# Altium project version 2.PrjPcb
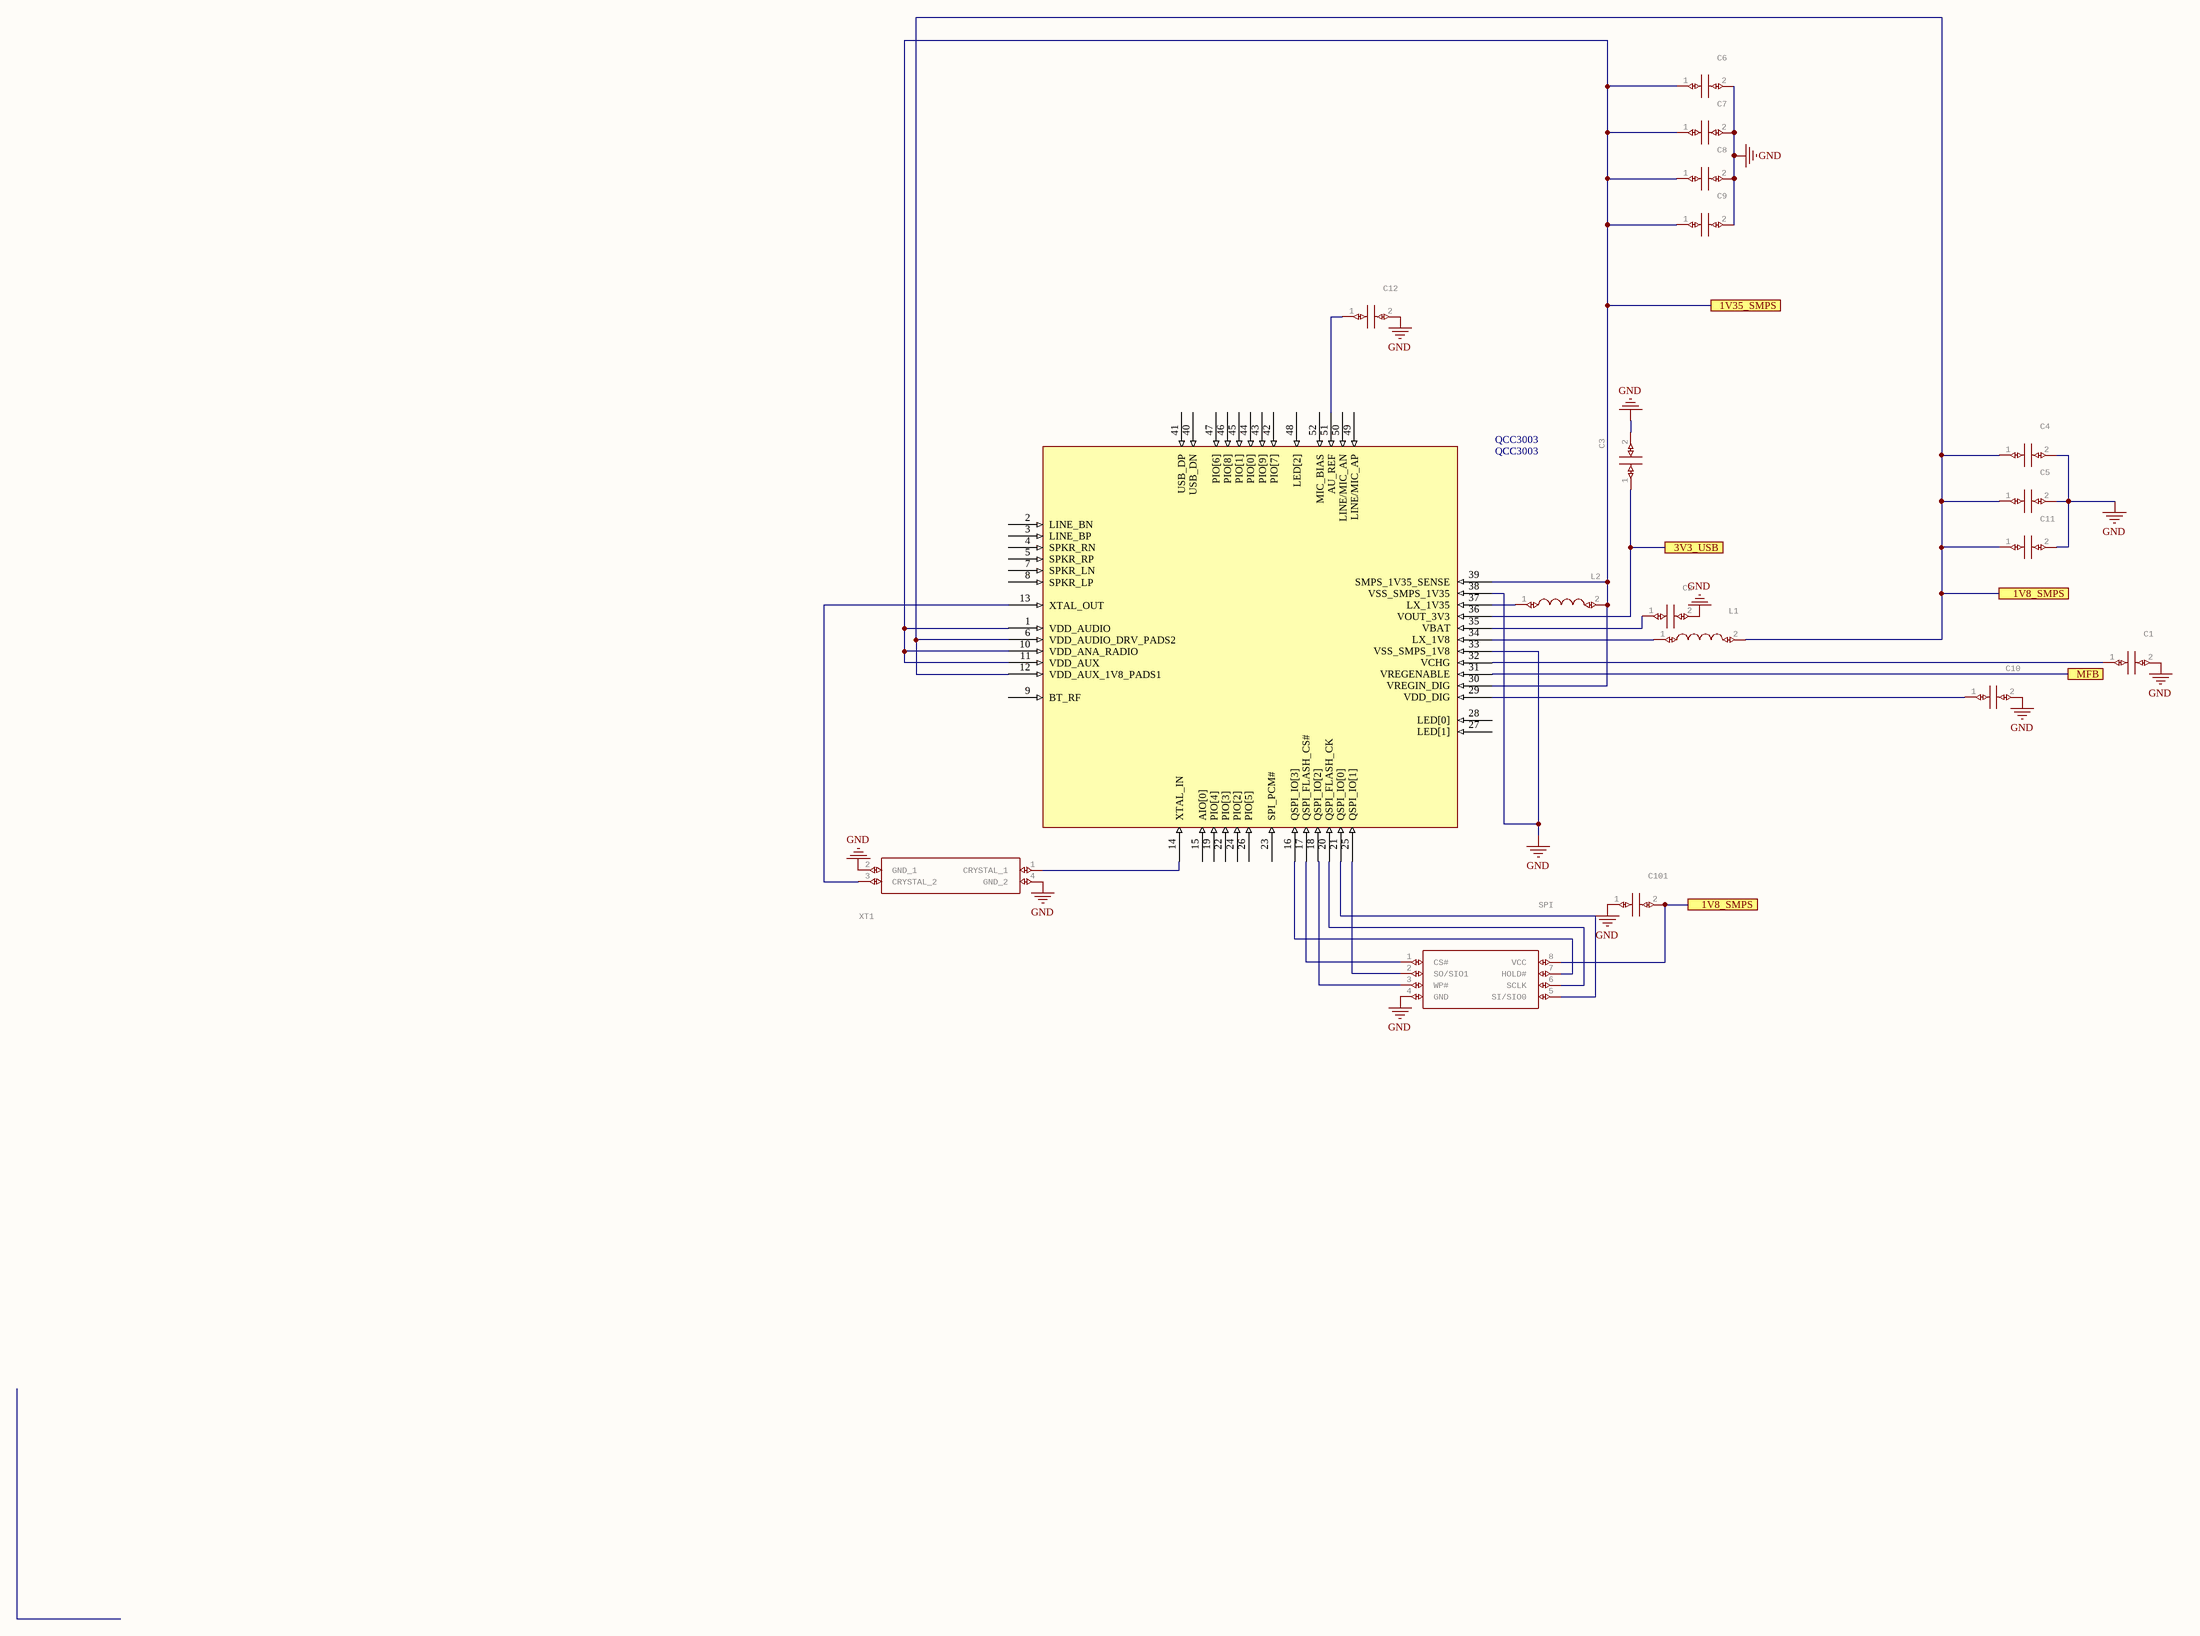
[diagram p0: Sheet2.SchDoc]
1 sheet, 18 parts. Net scope: flat (ports and power ports of the same name join across sheets).
Board file: PCB1.PcbDoc

## Sheet Sheet2.SchDoc
size A2

### Parts
C1  (no value)  [CAPC1608X90N]
C2  (no value)  [CAPC1608X90N]
C3  (no value)  [CAPC1608X90N]
C4  (no value)  [CAPC1608X90N]
C5  (no value)  [CAPC1608X90N]
C6  (no value)  [CAPC1608X90N]
C7  (no value)  [CAPC1608X90N]
C8  (no value)  [CAPC1608X90N]
C9  (no value)  [CAPC1608X90N]
C10  (no value)  [CAPC1608X90N]
C11  (no value)  [CAPC1608X90N]
C12  (no value)  [CAPC1608X90N]
C101  (no value)  [CAPC1608X90N]
L1  (no value)  [0603CS82NXGLW]
L2  (no value)  [0603CS82NXGLW]
QCC3003  QCC3003  [QFN40P600X600X60]
SPI  (no value)  [SOIC127P790X216-8N]
XT1  (no value)  [ABM1026000MHZD30T3]

### Ports
1V8_SMPS, 1V35_SMPS, 3V3_USB, MFB

### Nets
GND: C1.2 C2.2 C3.2 C4.2 C5.2 C6.2 C7.2 C8.2 C9.2 C10.2 C11.2 C12.2 C101.1 QCC3003.33(VSS_SMPS_1V8) QCC3003.38(VSS_SMPS_1V35) SPI.4(GND) XT1.2(GND_1) XT1.4(GND_2)
NetC1_1: C1.1 QCC3003.32(VCHG)
NetC2_1: C2.1 QCC3003.35(VBAT)
NetC3_1: C3.1 QCC3003.36(VOUT_3V3) ; port 3V3_USB
NetC4_1: C4.1 C5.1 C11.1 C101.2 L1.2 QCC3003.6(VDD_AUDIO_DRV_PADS2) QCC3003.12(VDD_AUX_1V8_PADS1) SPI.8(VCC) ; port 1V8_SMPS
NetC6_1: C6.1 C7.1 C8.1 C9.1 L2.2 QCC3003.1(VDD_AUDIO) QCC3003.10(VDD_ANA_RADIO) QCC3003.11(VDD_AUX) QCC3003.30(VREGIN_DIG) QCC3003.39(SMPS_1V35_SENSE) ; port 1V35_SMPS
NetC10_1: C10.1 QCC3003.29(VDD_DIG)
NetC12_1: C12.1 QCC3003.51(AU_REF)
NetL1_1: L1.1 QCC3003.34(LX_1V8)
NetL2_1: L2.1 QCC3003.37(LX_1V35)
NetQCC3003_13: QCC3003.13(XTAL_OUT) XT1.3(CRYSTAL_2)
NetQCC3003_14: QCC3003.14(XTAL_IN) XT1.1(CRYSTAL_1)
NetQCC3003_16: QCC3003.16(QSPI_IO[3]) SPI.7(HOLD#)
NetQCC3003_17: QCC3003.17(QSPI_FLASH_CS#) SPI.1(CS#)
NetQCC3003_18: QCC3003.18(QSPI_IO[2]) SPI.3(WP#)
NetQCC3003_20: QCC3003.20(QSPI_FLASH_CK) SPI.6(SCLK)
NetQCC3003_21: QCC3003.21(QSPI_IO[0]) SPI.5(SI/SIO0)
NetQCC3003_25: QCC3003.25(QSPI_IO[1]) SPI.2(SO/SIO1)
NetQCC3003_31: QCC3003.31(VREGENABLE) ; port MFB

Not connected (* = marked no-connect by the designer): QCC3003 2(LINE_BN) 3(LINE_BP) 4(SPKR_RN) 5(SPKR_RP) 7(SPKR_LN) 8(SPKR_LP) 9(BT_RF) 15(AIO[0]) 19(PIO[4]) 22(PIO[3]) 23(SPI_PCM#) 24(PIO[2]) 26(PIO[5]) 27(LED[1]) 28(LED[0]) 40(USB_DN) 41(USB_DP) 42(PIO[7]) 43(PIO[9]) 44(PIO[0]) 45(PIO[1]) 46(PIO[8]) 47(PIO[6]) 48(LED[2]) 49(LINE/MIC_AP) 50(LINE/MIC_AN) 52(MIC_BIAS)

### Library data of the parts
C1-C12 C101 = 06031A4R7BAT2A: Manufacturer_Name: AVX; GateName_1: G$1; SymbolName_1: 06031A4R7BAT2A; LibraryName: 06031A4R7BAT2A; DeviceSetName: 06031A4R7BAT2A; Package: CAPC1608X90N; Manufacturer_Part_Number: 06031A4R7BAT2A; Arrow_Part_Number: 06031A4R7BAT2A; Arrow_Price-Stock: https://www.arrow.com/en/products/06031a4r7bat2a/avx; Height: 0.9mm
L1 L2 = 0603CS-22NXJLU: Manufacturer_Name: COILCRAFT; GateName_1: G$1; SymbolName_1: 0603CS-22NXJLU; LibraryName: 0603CS-22NXJLU; DeviceSetName: 0603CS-22NXJLU; Package: 0603CS82NXGLW; Manufacturer_Part_Number: 0603CS-22NXJLU; Mouser_Part_Number: 994-0603CS-22NXJLU; Mouser_Price-Stock: http://www.mouser.com/Search/ProductDetail.aspx?qs=zCSbvcPd3pZzI0Qezu9TiA%3d%3d; Height: 1mm
SPI = MX25L1606EM2I-12G: Manufacturer_Name: Macronix; GateName_1: G$1; SymbolName_1: MX25L1606EM2I-12G; LibraryName: MX25L1606EM2I-12G; DeviceSetName: MX25L1606EM2I-12G; Package: SOIC127P790X216-8N; Manufacturer_Part_Number: MX25L1606EM2I-12G; Arrow_Part_Number: MX25L1606EM2I-12G; Arrow_Price-Stock: https://www.arrow.com/en/products/mx25l1606em2i-12g/macronix-international; Height: 2.16mm
XT1 = ABM10-26.000MHZ-D30-T3: Manufacturer_Name: ABRACON; GateName_1: G$1; SymbolName_1: ABM10-26.000MHZ-D30-T3; LibraryName: ABM10-26.000MHZ-D30-T3; DeviceSetName: ABM10-26.000MHZ-D30-T3; Package: ABM1026000MHZD30T3; Manufacturer_Part_Number: ABM10-26.000MHZ-D30-T3; Arrow_Part_Number: ABM10-26.000MHZ-D30-T3; Arrow_Price-Stock: https://www.arrow.com/en/products/abm10-26.000mhz-d30-t3/abracon; Mouser_Part_Number: 815-ABM10-26-D30T3; Mouser_Price-Stock: https://www.mouser.co.uk/ProductDetail/ABRACON/ABM10-26000MHZ-D30-T3?qs=yJy3i4hRrMjoFDiCOmitYA%3D%3D; Height: 0.5mm